# Altium schematic sheet MCLR.SchDoc
size A4; SheetNumber: 10; SheetTotal: 13
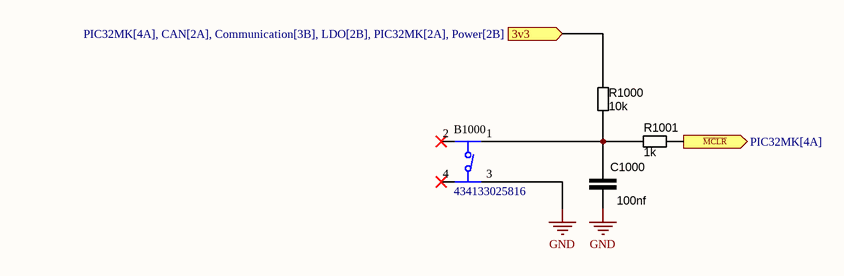
[diagram p0: MCLR.SchDoc]

## Parts
B1000  434133025816  [434133025816]
C1000  100nf  [CAP_0603]
R1000  10k  [RES_0603]
R1001  1k  [RES_0603]

## Ports
3v3 (in, see PIC32MK[4A], CAN[2A], Communication[3B], LDO[2B], PIC32MK[2A], Power[2B]), ~{MCLR} (out, see PIC32MK[4A])

## Nets
GND: B1000.3 C1000.1
3v3: R1000.2 ; port 3v3
~{MCLR}: R1001.1 ; port ~{MCLR}
NetB1000_1: B1000.1 C1000.2 R1000.1 R1001.2

Not connected (* = marked no-connect by the designer): B1000 2* 4*

## Library data of the parts
B1000 = 434133025816: <b> WS-TASV J-Bend SMT Tact Switch 4.2x3.2 mm  <br> <br> MATERIAL PROPERTIES  <br><br> </b>Cover Material Stainless Steel  <br> <br> <b>PROPERTIES  <br><br> </b>Actuator Material LCP  <br>Actuator Flammability Rating UL94 V-0  <br>Actuator Color Black; White  <br>Frame Material LCP  <br>Frame Flammability Rating UL94 V-0  <br>Frame Color Black  <br>Contact Material Stainless Steel  <br>Contact Plating Silver  <br>Terminal Material Copper Alloy  <br>Terminal Plating Silver  <br>VR 16 V (DC)  <br>Contact Resistance Initial 500 mÎ©  <br>Contact Resistance After Life Test 1 Î©  <br>RISO 100 MÎ©  <br>Withstanding Voltage 250 V (AC)  <br>Qty. 2900  <br><br> <b>Mechanical Properties</b><br> <br>Stroke  0.2 mm  <br><br> <b>GENERAL INFORMATION  <br><br> </b>Operating Temperature -40 up to +85 Â°C  <br> <br> </b>PACKAGING PROPERTIES  <br><br> </b>Packaging Tape and Reel  <br> <br> <br><a href="https://www.we-online.com/catalog/media/o106805v209%20Family_WS-TASV-4341x30258x6_Gruppe.jpg" title="Enlarge picture"> <img src="https://www.we-online.com/catalog/media/o106805v209%20Family_WS-TASV-4341x30258x6_Gruppe.jpg" width="320"></a><p> Details see: <a href="https://www.we-online.com/catalog/en/TASV_4_2X3_2_SMD_J-BEND/">https://www.we-online.com/catalog/en/TASV_4_2X3_2_SMD_J-BEND/</a><p> </b>Created by Yingchun,Shan 2020-02-20<br> </b>2020(C) Wurth Elektronik; MF: {'manufacturer': u'Wurth Electronics'}; Package: None; Price: None; Value: *; MP: 434133025816; Availability: Unavailable
C1000 = C000007: CAP CER 100nF 0603 25V X7R; capaticanse: 100nf; ComponentLink1Description: digikey; ComponentLink1URL: https://www.digikey.com/en/products/detail/kyocera-avx/06033C104K4T2A/8019250
R1000 = R000006: RES 10K OHM 1% 1/10W 0603; resistance: 100Kohm; ComponentLink1Description: digikey; ComponentLink1URL: https://www.digikey.com/en/products/detail/stackpole-electronics-inc/RMCF0603FG100K/1713543
R1001 = R000006: RES 1K OHM 1% 1/10W 0603; resistance: 100Kohm; ComponentLink1Description: digikey; ComponentLink1URL: https://www.digikey.com/en/products/detail/stackpole-electronics-inc/RMCF0603FG100K/1713543